# EasyEDA schematic schematic.json
TITLE: Sheet_1; REV: 1.0; Date: 2024-07-11; Sheet: 1/1; Drawn By: alphabitss1; Company: Your Company
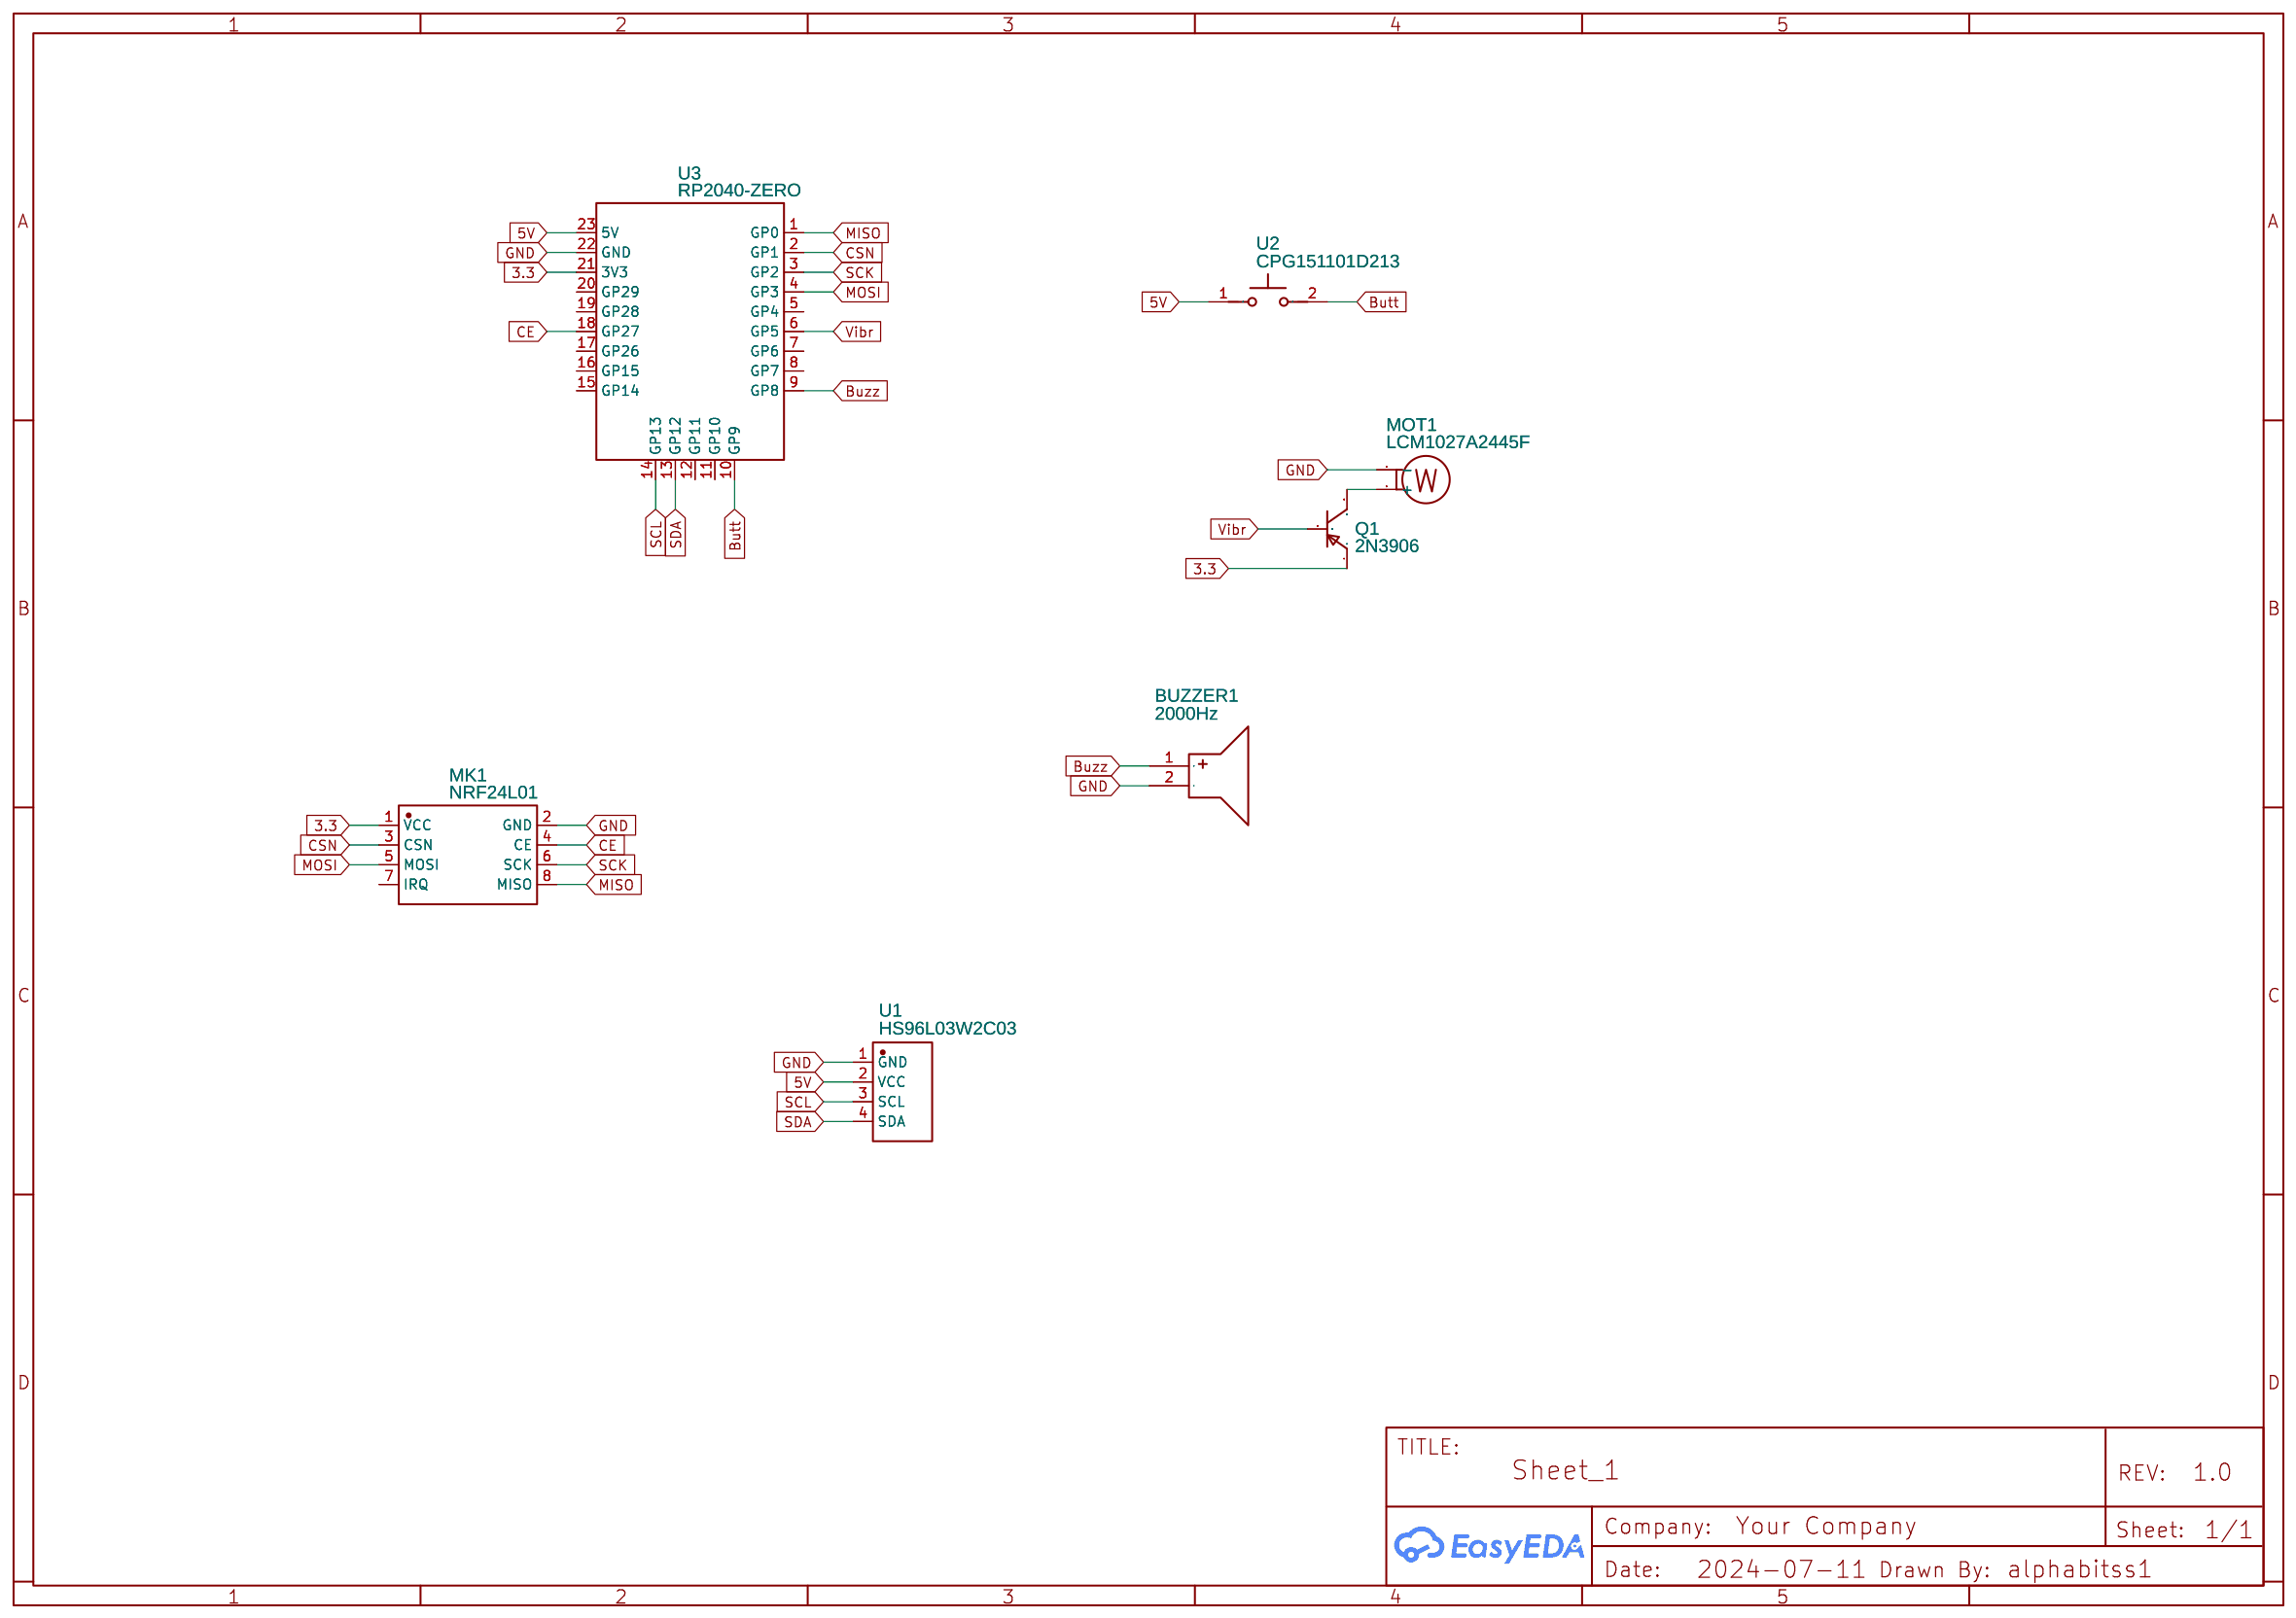
[diagram p0: schematic sheet]

## Parts
BUZZER1  2000Hz  [BUZ-TH_BD12.0-P6.50-D0.6-FD]
MK1  NRF24L01  [WIRELM-SMD_NRF24L01]
MOT1  LCM1027A2445F  [VIBRATING-MOTOR-SMD_WELDING]
Q1  2N3906  [TO-92-3_L4.9-W3.7-P1.27-L]
U1  HS96L03W2C03  [OLED-TH_L27.8-W27.2-P2.54_C9900033791]
U2  CPG151101D213  [KEY-TH_CPG151101D21X]
U3  RP2040-ZERO  [COMM-SMD_RP2040-ZERO]

## Library data of the parts
BUZZER1 = FS1265-05: Contributor: LCSC; Supplier: LCSC; Supplier Part: C482350; Manufacturer: FUET(福声科技); JLCPCB Part Class: Extended Part
MK1 = NRF24L01: Supplier: LCSC; Manufacturer: Ai-Thinker(安信可); Manufacturer Part: NF-04; Supplier Part: C90751; JLCPCB Part Class: Extended Part
MOT1 = LCM1027A2445F: Contributor: lcsc; Supplier: LCSC; Supplier Part: C2759984; Manufacturer: LEADER(立得); JLCPCB Part Class: Extended Part
Q1 = 2N3906: Supplier: LCSC; Manufacturer: CJ(江苏长电/长晶); Supplier Part: C9809; JLCPCB Part Class: Extended Part
U1 = HS96L03W2C03: Contributor: lcsc; Supplier: LCSC; Supplier Part: C5248080; Manufacturer: HS(汉昇); JLCPCB Part Class: Extended Part
U2 = CPG151101D213: Contributor: lcsc; Supplier: LCSC; Supplier Part: C400235; Manufacturer: Kailh(凯华); JLCPCB Part Class: Extended Part
U3 = RP2040-ZERO: Supplier: LCSC; Supplier Part: C5350143; Manufacturer: Waveshare(微雪电子); Manufacturer Part: RP2040-Zero; JLCPCB Part Class: Extended Part; Contributor: lcsc

## Nets
5V: U1.2(VCC) U2.1 U3.23(5V)
GND: BUZZER1.2(-) MK1.2(GND) MOT1.1(-) U1.1(GND) U3.22(GND)
3.3: MK1.1(VCC) Q1.1(E) U3.21(3V3)
Butt: U2.2 U3.10(GP9)
Buzz: BUZZER1.1(+) U3.9(GP8)
CE: MK1.4(CE) U3.18(GP27)
CSN: MK1.3(CSN) U3.2(GP1)
MISO: MK1.8(MISO) U3.1(GP0)
MOSI: MK1.5(MOSI) U3.4(GP3)
SCK: MK1.6(SCK) U3.3(GP2)
SCL: U1.3(SCL) U3.14(GP13)
SDA: U1.4(SDA) U3.13(GP12)
Vibr: Q1.2(B) U3.6(GP5)
Net-(MOT1-2): MOT1.2(+) Q1.3(C)

Not connected (* = marked no-connect by the designer): MK1 7(IRQ); U3 5(GP4) 7(GP6) 8(GP7) 11(GP10) 12(GP11) 15(GP14) 16(GP15) 17(GP26) 19(GP28) 20(GP29)
